# EAGLE design StickSoc_Left (EAGLE 6.6.0)
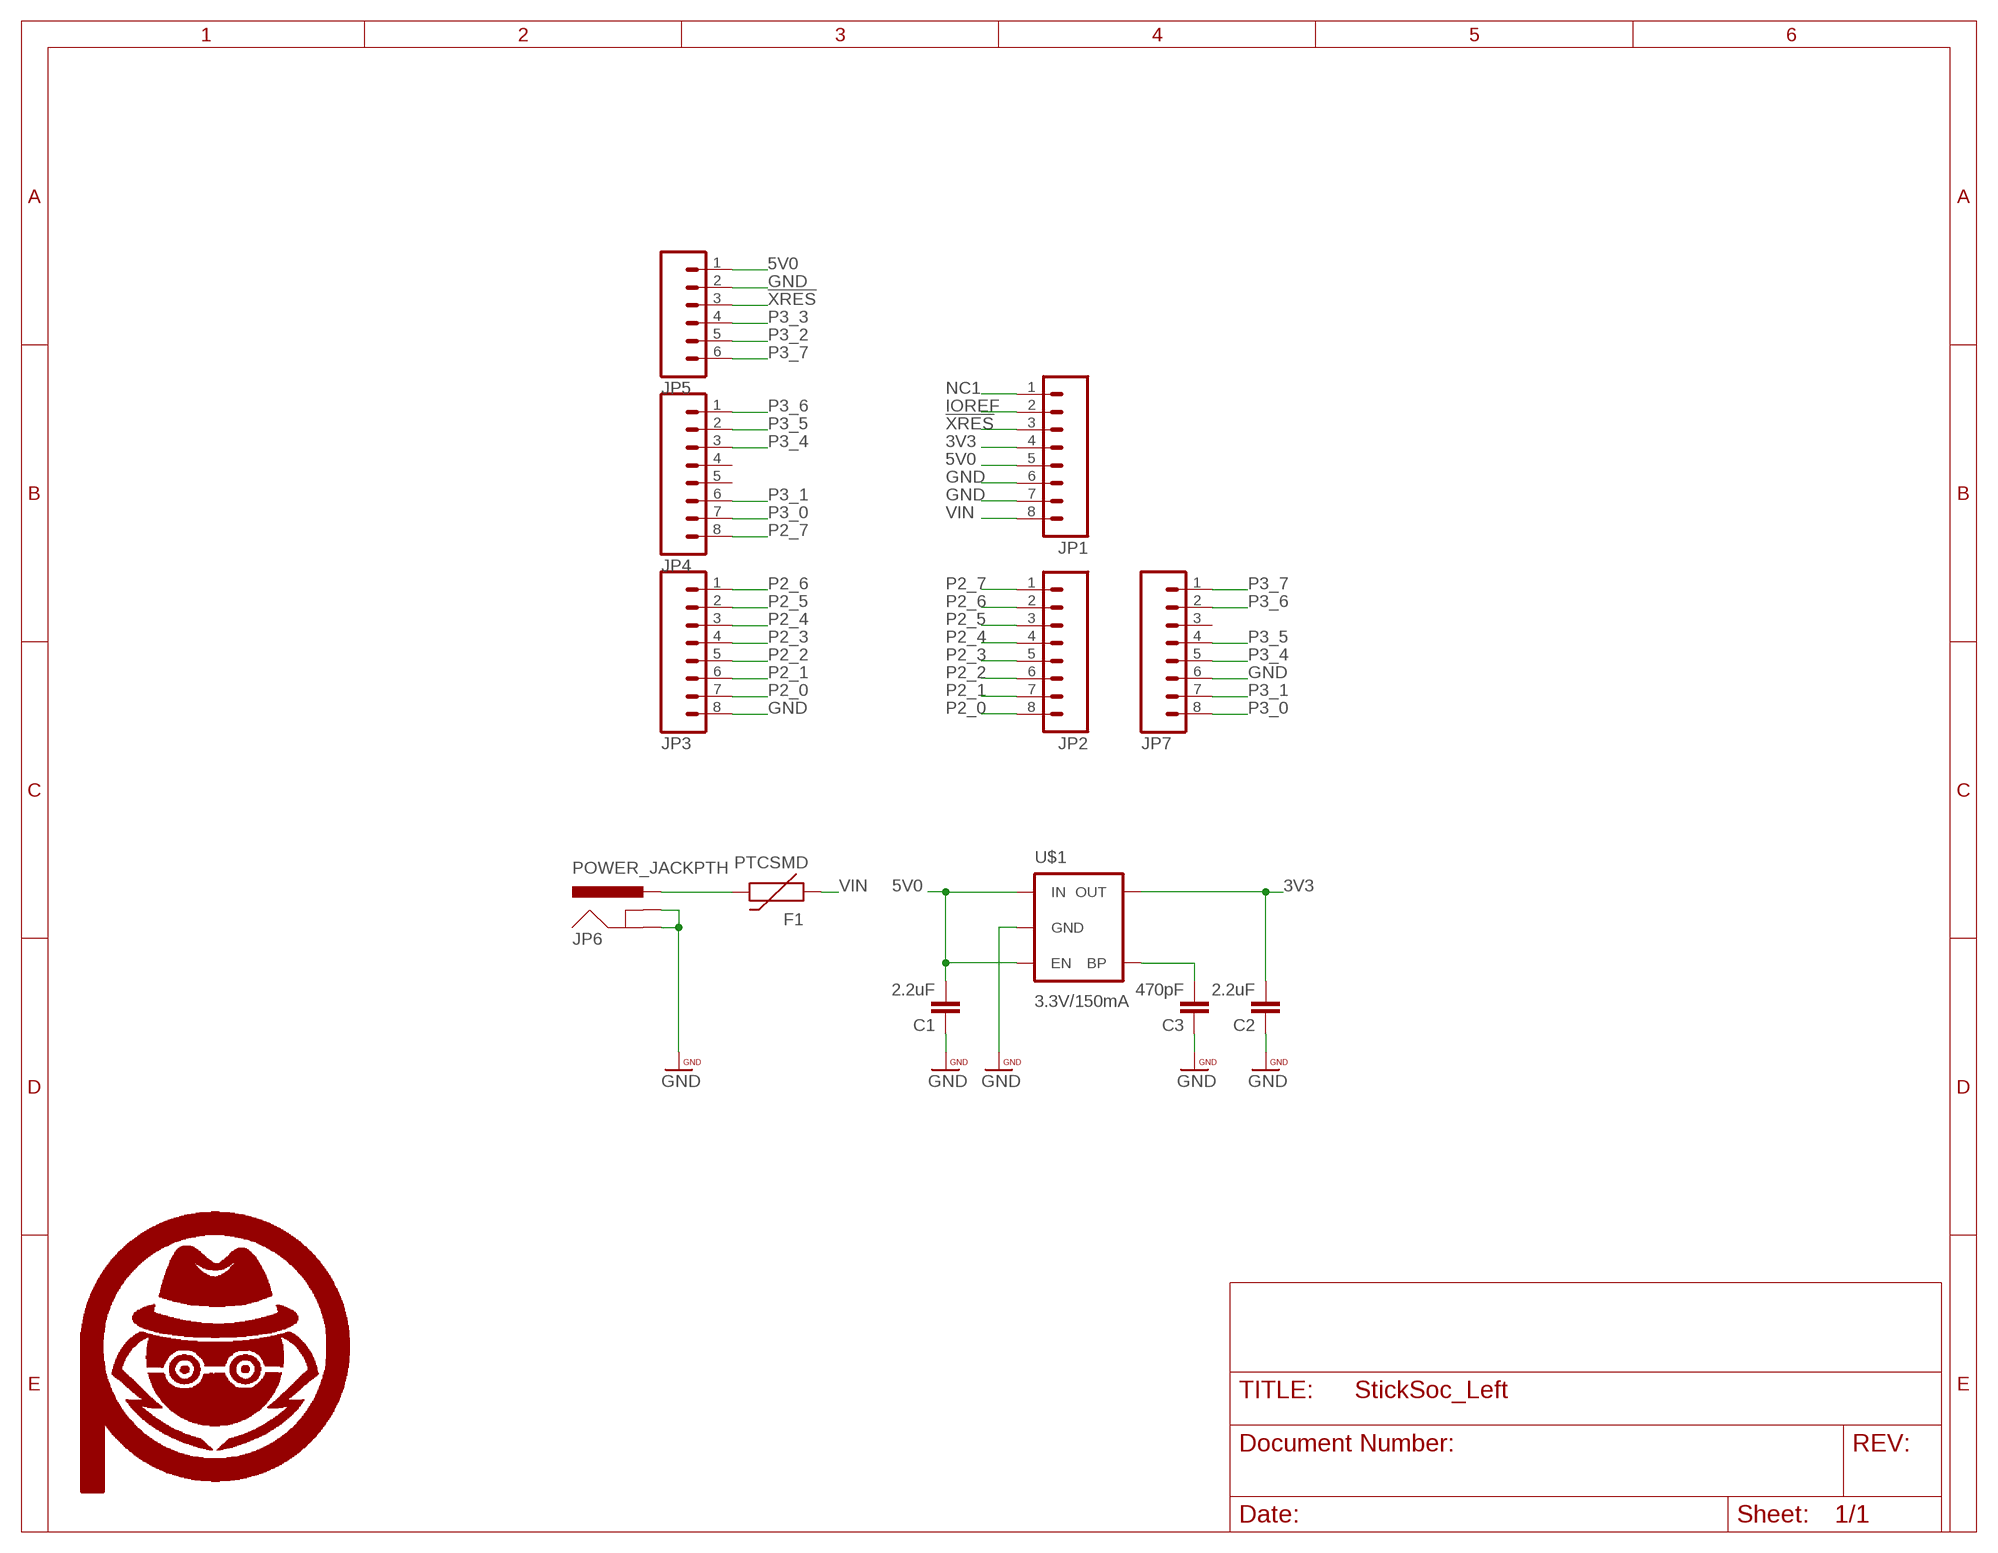
[diagram p0: schematic, sheet 1]

## Parts
C1  2.2uF  CAP0805  [0805]
C2  2.2uF  CAP0805  [0805]
C3  470pF  CAP0805  [0805]
F1  PTCSMD  [PTC-1206]
JP1  M081X08  [1X08]
JP2  M081X08  [1X08]
JP3  M081X08  [1X08]
JP4  M081X08  [1X08]
JP5  M06SIP  [1X06]
JP6  POWER_JACKPTH  [POWER_JACK_PTH]
JP7  M081X08  [1X08]
U$1  3.3V/150mA  V_REG_MIC52053.3V  [SOT23-5]
U$7  PA_LOGO_SYMSMALL  [PA_LOGO_AGENT_SMALL_SYM]
U$8  PA_LOGO_SYMSMALL  [PA_LOGO_AGENT_SMALL_SYM]

## Nets
3V3: C2.2 JP1.4 U$1.5(OUT)
5V0: C1.2 JP1.5 JP5.1 U$1.1(IN) U$1.3(EN)
!XRES: JP1.3 JP5.3
GND: C1.1 C2.1 C3.1 JP1.6 JP1.7 JP3.8 JP5.2 JP6.GND JP6.GNDBREAK JP7.6 U$1.2(GND)
IOREF: JP1.2
N$1: F1.2 JP6.PWR
N$3: C3.2 U$1.4(BP)
NC1: JP1.1
P2_0: JP2.8 JP3.7
P2_1: JP2.7 JP3.6
P2_2: JP2.6 JP3.5
P2_3: JP2.5 JP3.4
P2_4: JP2.4 JP3.3
P2_5: JP2.3 JP3.2
P2_6: JP2.2 JP3.1
P2_7: JP2.1 JP4.8
P3_0: JP4.7 JP7.8
P3_1: JP4.6 JP7.7
P3_2: JP5.5
P3_3: JP5.4
P3_4: JP4.3 JP7.5
P3_5: JP4.2 JP7.4
P3_6: JP4.1 JP7.2
P3_7: JP5.6 JP7.1
VIN: F1.1 JP1.8
Unconnected: JP4.4 JP4.5 JP7.3

## Library data of the parts
C1-C3 = SparkFun-Passives:CAP: Capacitor Standard 0603 ceramic capacitor, and 0.1" leaded capacitor.
F1 = SparkFun-PowerIC:PTC: Resettable Fuse PTC Resettable Fuse. Spark Fun Electronics SKU : COM-08357; PROD_ID: RES-11150
JP1-JP4 JP7 = moxdes_std:M08: Header 8 Standard 8-pin 0.1" header. Use with straight break away headers (SKU : PRT-00116), right angle break away headers (PRT-00553), swiss pins (PRT-00743), machine pins (PRT-00117), and female headers (PRT-00115).
JP5 = moxdes_std:M06: Header 6 Standard 6-pin 0.1" header. Use with straight break away headers (SKU : PRT-00116), right angle break away headers (PRT-00553), swiss pins (PRT-00743), machine pins (PRT-00117), and female headers (PRT-00115). Molex polarized connector foot print use with SKU : PRT-08094 with associated crimp pins and housings. NOTES ON THE VARIANTS LOCK and LOCK_LONGPADS... This footprint was designed to help hold the alignment of a through-hole component (i.e. 6-pin header) while soldering it into place. You may notice that each hole has been shifted either up or down by 0.005 of an inch from it's more standard position (which is a perfectly straight line). This slight alteration caused the pins (the squares in the middle) to touch the edges of the holes. Because they are alternating, it causes a "brace" to hold the component in place. 0.005 has proven to be the perfect amount of "off-center" position when using our standard breakaway headers. Although looks a little odd when you look at the bare footprint, once you have a header in there, the alteration is very hard to notice. Also, if you push a header all the way into place, it is covered up entirely on the bottom side. This idea of altering the position of holes to aid alignment will be further integrated into the Sparkfun Library for other footprints. It can help hold any component with 3 or more connection pins.
JP6 = SparkFun-Connectors:POWER_JACK: Power Jack This is the standard 5.5mm barrel jack for power. The PTH is the most common, proven, reliable, footprint. The Slot footprint only works if the mill layer is transmitted to the PCB fab house so be warned. Mating wall wart : TOL-00298 (and others); PROD_ID: CONN-08197
U$1 = SparkFun-PowerIC:V_REG_MIC5205: V_REG MIC5219 Standard 3.3V and 5V 150mA LDO voltage regulator in SOT-23 layout. Micrel part MIC5205. BP (by-pass) pin is used to lower output noise with 470pF cap, may be left open.; PROD_ID: VREG-00822
U$7 U$8 = PatternAgents-Logos:PA_LOGO_SYM: PatternAgents Logo Symbol Trademark : PatternAgents, LLC Github : https://github.com/PatternAgents/PCB_Libraries License : http://creativecommons.org/licenses/by-sa/3.0/ (Creative Commons 3.0) THIS SOFTWARE IS PROVIDED BY THE CONTRIBUTORS "AS IS" AND WITHOUT ANY EXPRESS OR IMPLIED WARRANTIES, INCLUDING, BUT NOT LIMITED TO, THE IMPLIED WARRANTIES OF MERCHANTABILITY AND FITNESS FOR A PARTICULAR PURPOSE ARE DISCLAIMED. IN NO EVENT SHALL THE COPYRIGHT OWNER OR CONTRIBUTORS BE LIABLE FOR ANY DIRECT, INDIRECT, INCIDENTAL, SPECIAL, EXEMPLARY, OR CONSEQUENTIAL DAMAGES (INCLUDING, BUT NOT LIMITED TO, PROCUREMENT OF SUBSTITUTE GOODS OR SERVICES; LOSS OF USE, DATA, OR PROFITS; OR BUSINESS INTERRUPTION) HOWEVER CAUSED AND ON ANY THEORY OF LIABILITY, WHETHER IN CONTRACT, STRICT LIABILITY, OR TORT (INCLUDING NEGLIGENCE OR OTHERWISE) ARISING IN ANY WAY OUT OF THE USE OF THIS SOFTWARE, EVEN IF ADVISED OF THE POSSIBILITY OF SUCH DAMAGE.

## Board
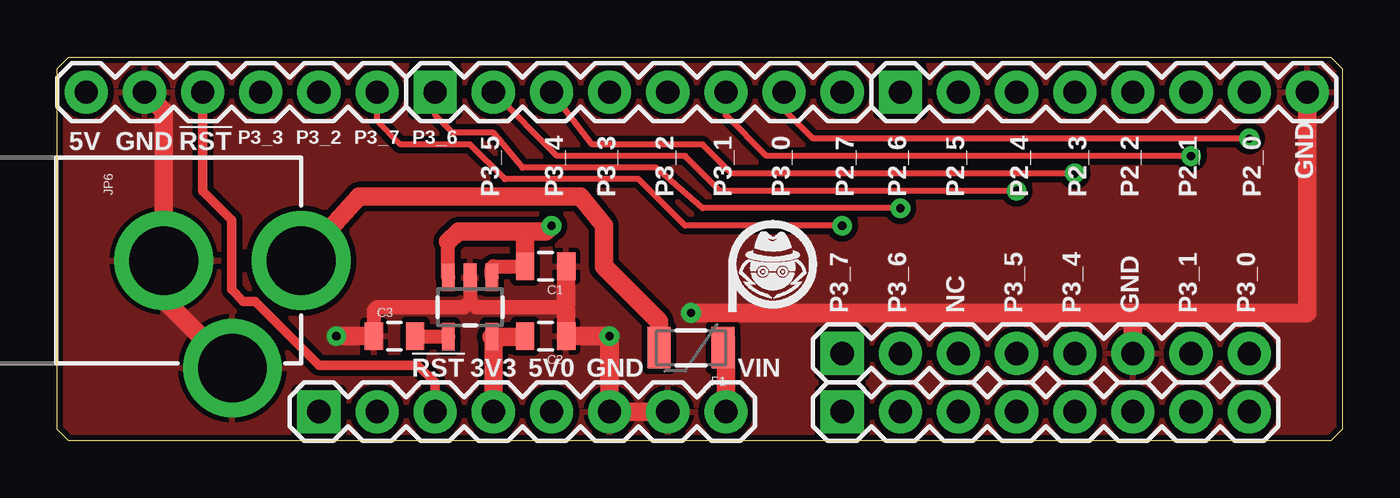
[diagram p1: board, top side]
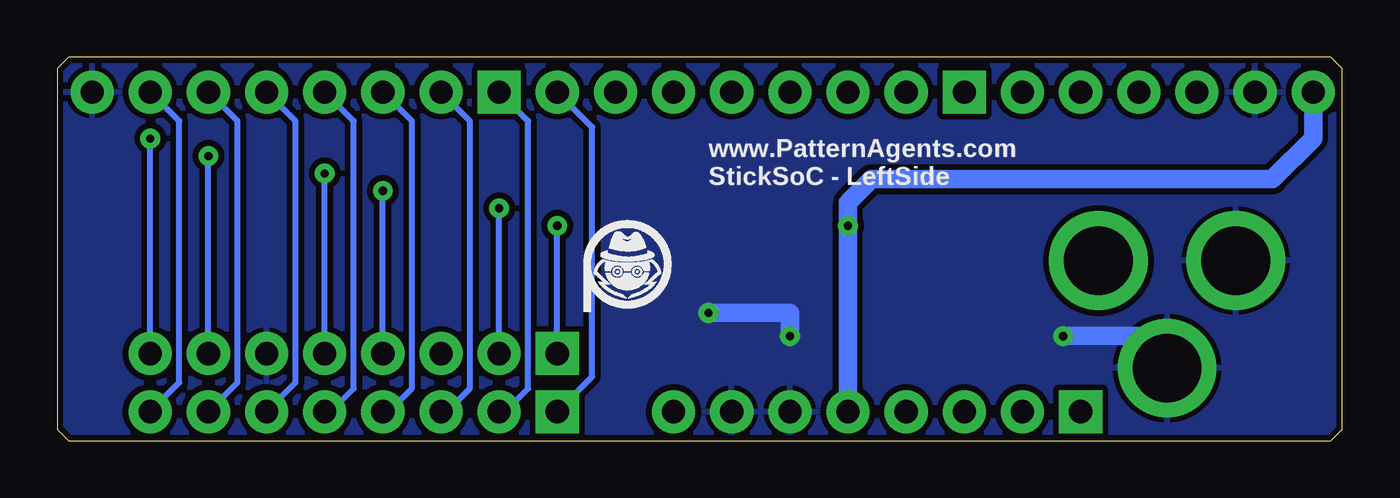
[diagram p2: board, bottom side, seen from below]

Size 56.13 x 16.76 mm. Coordinates in mm from the lower left corner, seen from the top.
Outline: 0.51,0 0,0.51 0,16.26 0.51,16.76 55.63,16.76 56.13,16.26 56.13,0.51 55.63,0 0.51,0
Copper layers (1*16): Top 0.035mm / dielectric 1.5mm / Bottom 0.035mm
Design rules "PatternAgents": minimum track width 8mil, minimum drill 14mil, track to track 8mil, track to pad 8mil, pad to pad 8mil, via to via 8mil, smd to smd 8mil, copper to edge 10mil, drill to drill 8mil, minimum pad ring 12mil, minimum via ring 10mil, stop-mask expansion 4mil, vias tented up to drill 25mil, thermal gap 8mil

### Footprints (pad centres in the part's own frame; a part is rotated, then mirrored left to right if it is on the bottom)
0805 = smd 0.8 x 1.2: 1 -0.9,0; 2 0.9,0
PTC-1206 = smd 1 x 1.8: 1 -1.4,0; 2 1.4,0
1X08 = drill 1.016 pad 1.88 square: 1 0,0 | drill 1.016 pad 1.88: 2 2.54,0; 3 5.08,0; 4 7.62,0; 5 10.16,0; 6 12.7,0; 7 15.24,0; 8 17.78,0
1X06 = drill 1.016 pad 1.88: 1 0,0; 2 2.54,0; 3 5.08,0; 4 7.62,0; 5 10.16,0; 6 12.7,0
POWER_JACK_PTH = drill 2.997 pad 4.318: GND 0,7.7; GNDBREAK 4.7,10.7; PWR 0,13.7
SOT23-5 = smd 0.55 x 1.2: 1 -0.95,-1.3; 2 0,-1.3; 3 0.95,-1.3; 4 0.95,1.3; 5 -0.95,1.3

### Placement (x,y rotation side)
C1  21.34,7.62 180 top
C2  21.34,4.57 180 top
C3  14.73,4.57 0 top
F1  27.69,4.06 180 top
JP1  11.43,1.27 0 top
JP2  34.29,1.27 0 top
JP3  36.83,15.24 0 top
JP4  16.51,15.24 0 top
JP5  1.27,15.24 0 top
JP6  -3.05,7.87 270 top
JP7  34.29,3.81 0 top
U$1  18.03,5.84 180 top
U$7  31.24,7.37 0 top
U$8  31.24,7.37 0 bottom

### Tracks (layer width: path | path; a pad name or v marks a point on that pad's centre or on a via)
3V3
  Top 0.813: JP1.4 19.05,4.48 U$1.5 20.41,4.54 C2.2
5V0  (via drill 0.36)
  Top 0.61: U$1.3 17.08,8.7 | U$1.1 18.98,7.55 19.05,7.62 C1.2
  Top 0.813: 17.08,8.7 17.53,9.14 20.57,9.14 | 20.57,9.14 21.34,9.14 v21.59,9.4 | C1.2 20.44,9.01 20.57,9.14
  Bottom 0.813: JP1.5 v21.59,9.4 21.59,10.41 20.57,11.43 3.05,11.43 1.27,13.21 JP5.1
!XRES
  Top 0.406: JP5.3 6.35,10.92 7.62,9.65 7.62,6.6 8.13,6.1 8.64,6.1 11.43,3.3 15.75,3.3 16.51,2.54 JP1.3
GND  (via drill 0.36)
  Top 0.61: U$1.2 18.03,6.1 | 18.03,6.1 18.29,5.84 22.1,5.84 22.24,5.73 | C3.1 13.83,5.7 13.97,5.84 17.78,5.84 18.03,6.1
  Top 0.813: 22.24,5.73 C2.1 v24.13,4.57 JP1.6 JP1.7 | C1.1 22.24,5.98 22.1,5.84 | JP6.GNDBREAK 4.65,6.17 JP6.GND 4.65,14.4 JP5.2 | C3.1 v12.19,4.57 | JP7.6 46.99,5.59 | 46.99,5.59 54.61,5.59 JP3.8 | v27.69,5.59 46.99,5.59
  Bottom 0.813: JP6.GNDBREAK 7.65,3.59 8.64,4.57 v12.19,4.57 | v24.13,4.57 24.13,5.59 v27.69,5.59
  pour Top (isolate 0.254, rank 2): 0.51,0 0,0.51 0,16.26 0.51,16.76 55.63,16.76 56.13,16.26 56.13,0.51 55.63,0
  pour Bottom (isolate 0.254, rank 2): 0.51,0 0,0.51 0,16.26 0.51,16.76 55.63,16.76 56.13,16.26 56.13,0.51 55.63,0 0.76,0
N$1
  Top 0.813: F1.2 26.29,5.21 23.88,7.62 23.88,9.4 22.86,10.67 13.19,10.67 JP6.PWR
N$3
  Top 0.61: U$1.4 15.66,4.54 C3.2
P2_0
  Bottom 0.254: JP2.8 50.8,2.54 50.8,13.97 JP3.7
P2_1
  Bottom 0.254: JP2.7 48.26,2.54 48.26,13.97 JP3.6
P2_2
  Bottom 0.254: JP2.6 45.72,2.54 45.72,13.97 JP3.5
P2_3
  Bottom 0.254: JP2.5 44.2,1.27 43.18,2.29 43.18,13.97 JP3.4
P2_4
  Bottom 0.254: JP2.4 41.66,1.27 40.64,2.29 40.64,13.97 JP3.3
P2_5
  Bottom 0.254: JP2.3 39.12,1.27 38.1,2.29 38.1,13.97 JP3.2
P2_6
  Bottom 0.254: JP2.2 36.58,1.27 35.56,2.29 35.56,13.97 JP3.1
P2_7
  Bottom 0.254: JP2.1 32.77,2.79 32.77,13.72 JP4.8
P3_0  (via drill 0.36)
  Top 0.254: v52.07,13.21 33.02,13.21 31.75,14.48 JP4.7
  Bottom 0.254: JP7.8 v52.07,13.21
P3_1  (via drill 0.36)
  Top 0.254: v49.53,12.45 30.99,12.45 29.21,14.22 JP4.6
  Bottom 0.254: JP7.7 v49.53,12.45
P3_4  (via drill 0.36)
  Top 0.254: v44.45,11.68 29.46,11.68 28.19,12.95 23.37,12.95 JP4.3
  Bottom 0.254: JP7.5 v44.45,11.68
P3_5  (via drill 0.36)
  Top 0.254: v41.91,10.92 28.96,10.92 27.43,12.45 21.84,12.45 JP4.2
  Bottom 0.254: JP7.4 v41.91,10.92
P3_6  (via drill 0.36)
  Top 0.254: v36.83,10.16 28.19,10.16 26.16,11.94 20.32,11.94 19.05,13.46 17.27,13.46 16.51,14.22 JP4.1
  Bottom 0.254: JP7.2 v36.83,10.16
P3_7  (via drill 0.36)
  Top 0.254: v34.29,9.4 27.43,9.4 25.4,11.43 19.56,11.43 18.03,12.95 14.99,12.95 13.97,13.97 JP5.6
  Bottom 0.254: JP7.1 v34.29,9.4
VIN
  Top 0.813: JP1.8 29.21,4.45 F1.1

### Text on the board
tPlace: 5V | GND | !RST | P3_3 | P3_2 | P3_7 | P3_6 | P3_5 | P3_4 | P3_3 | P3_2 | P3_1 | P3_0 | P2_7 | P2_6 | P2_5 | P2_4 | P2_3 | P2_2 | P2_1 | P2_0 | GND | P3_7 | P3_6 | NC | P3_5 | P3_4 | GND | P3_1 | P3_0 | !RST | 3V3 | 5V0 | GND | VIN
bPlace: www.PatternAgents.com / StickSoC - LeftSide